# EAGLE design breakout (EAGLE 6.5.0)
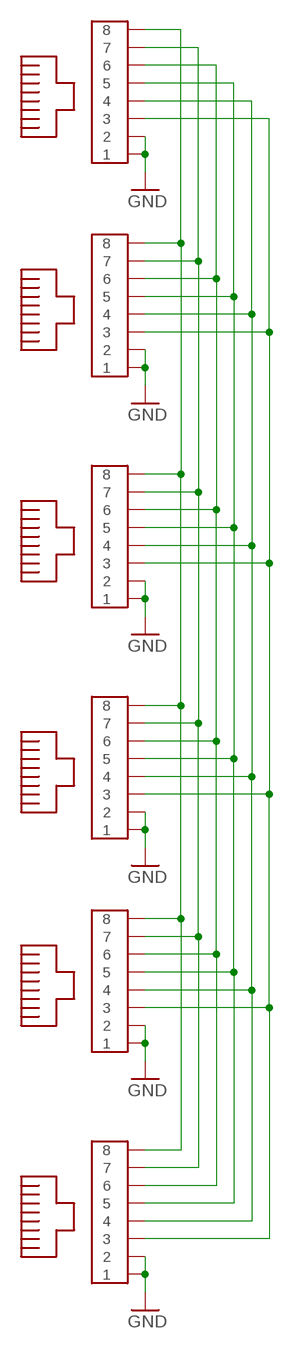
[diagram p0: schematic, sheet 1]

## Parts
U$1  MOLEX-RJ45-SMT  [MOLEX-RJ45-SMT]
U$2  MOLEX-RJ45-SMT  [MOLEX-RJ45-SMT]
U$3  MOLEX-RJ45-SMT  [MOLEX-RJ45-SMT]
U$4  MOLEX-RJ45-SMT  [MOLEX-RJ45-SMT]
U$5  MOLEX-RJ45-SMT  [MOLEX-RJ45-SMT]
U$6  MOLEX-RJ45-SMT  [MOLEX-RJ45-SMT]

## Nets
GND: U$1.1 U$1.2 U$2.1 U$2.2 U$3.1 U$3.2 U$4.1 U$4.2 U$5.1 U$5.2 U$6.1 U$6.2
N$3: U$1.4 U$2.4 U$3.4 U$4.4 U$5.4 U$6.4
N$4: U$1.3 U$2.3 U$3.3 U$4.3 U$5.3 U$6.3
N$6: U$1.5 U$2.5 U$3.5 U$4.5 U$5.5 U$6.5
N$7: U$1.8 U$2.8 U$3.8 U$4.8 U$5.8 U$6.8
N$8: U$1.6 U$2.6 U$3.6 U$4.6 U$5.6 U$6.6
N$13: U$1.7 U$2.7 U$3.7 U$4.7 U$5.7 U$6.7

## Library data of the parts
U$1-U$6 = SMD-RJ45:MOLEX-RJ45-SMT

## Board
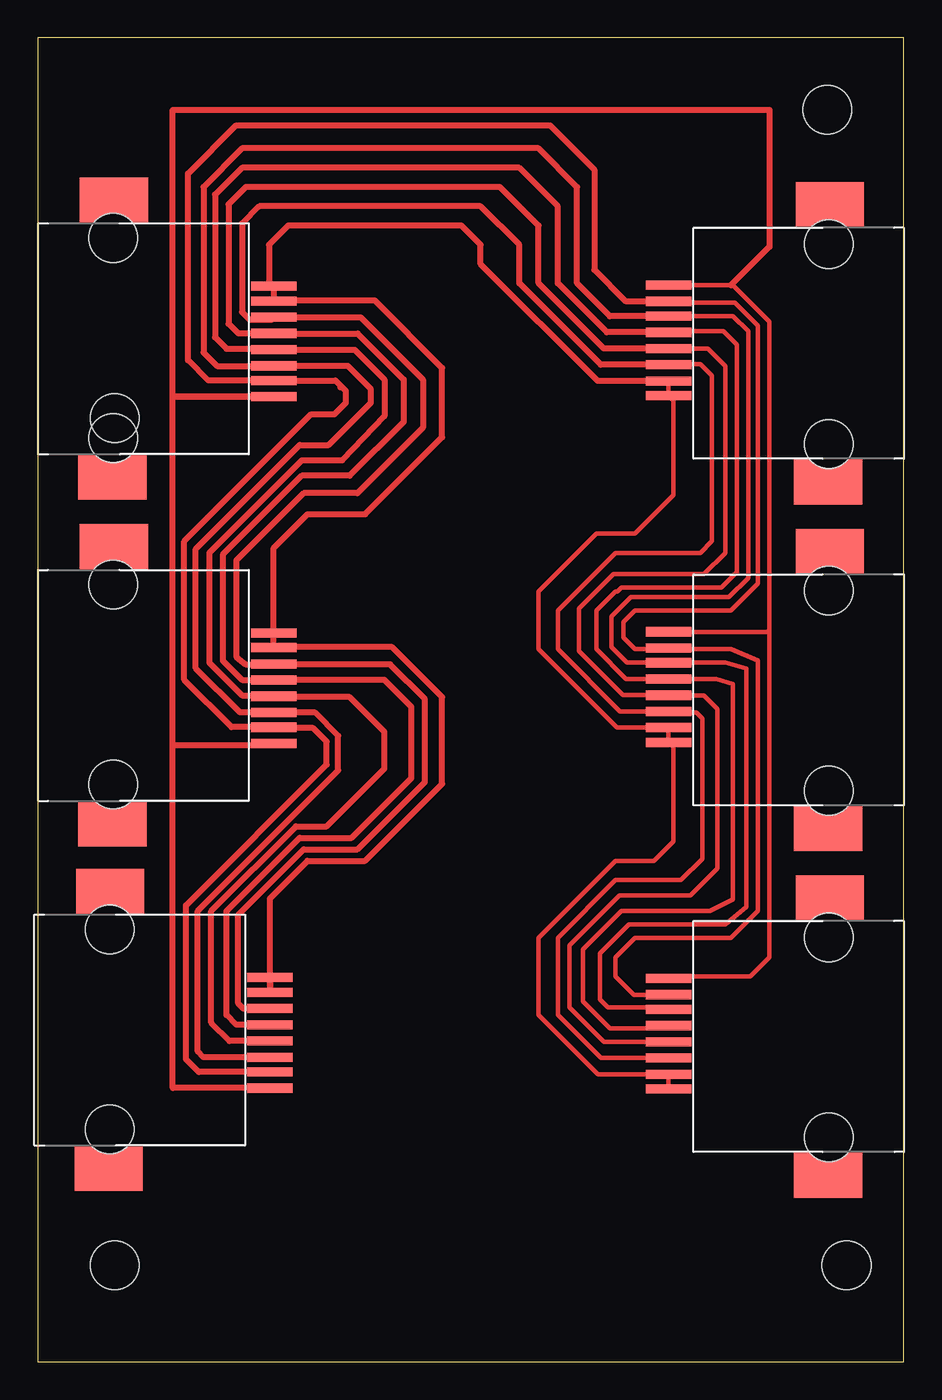
[diagram p1: board, top side]

Size 57.13 x 87.3 mm. Coordinates in mm from the lower left corner, seen from the top.
Outline: 0,0 57.13,0 57.13,87.3 0,87.3 0,0
Copper layers (1*16): Top 0.035mm / dielectric 1.5mm / Bottom 0.035mm
Design rules "default": minimum track width 10mil, minimum drill 24mil, track to track 8mil, track to pad 8mil, pad to pad 8mil, via to via 8mil, smd to smd 8mil, copper to edge 40mil, drill to drill 8mil, minimum pad ring 10mil, minimum via ring 8mil, stop-mask expansion 4mil, vias tented up to drill 0mil, thermal gap 10mil
Holes 3.2 mm at 52.07,82.55 5.08,6.35 53.34,6.35 5.08,62.23

### Footprints (pad centres in the part's own frame; a part is rotated, then mirrored left to right if it is on the bottom)
MOLEX-RJ45-SMT = smd 3 x 0.6: 1 10.48,3.61; 2 10.48,2.64; 3 10.48,1.57; 4 10.48,0.5; 5 10.48,-0.57; 6 10.48,-1.64; 7 10.48,-2.61; 8 10.48,-3.68 | smd 4.5 x 3: P$1 -0.16,-8.97; P$2 -0.06,9.28 | hole 3.2: -0.1,6.8; -0.1,-6.4

### Placement (x,y rotation side)
U$1  5.08,67.31 0 top
U$2  52.07,67.31 180 top
U$3  52.07,21.59 180 top
U$4  52.07,44.45 180 top
U$5  5.08,44.45 0 top
U$6  4.83,21.72 0 top

### Tracks (layer width: path | path; a pad name or v marks a point on that pad's centre or on a via)
GND
  Top 0.254: 41.91,40.64 U$4.1 41.91,40.64
  Top 0.305: U$2.2 U$2.1 41.91,63.38 41.91,57.15 39.37,54.61 36.83,54.61 33.02,50.8 33.02,46.99 38.2,41.81 U$4.2 U$4.1 41.91,40.52 41.91,34.29 40.64,33.02 38.1,33.02 33.02,27.94 33.02,22.86 36.93,18.95 U$3.2 U$3.1
  Top 0.406: U$5.2 U$5.1 | U$6.1 U$6.2 15.31,30.55 17.78,33.02 21.59,33.02 26.67,38.1 26.67,43.81 23.37,47.12 15.59,47.12 U$5.2 | U$5.2 15.56,53.66 17.78,55.88 21.59,55.88 26.67,60.96 26.67,65.53 22.22,69.98 15.59,69.98 U$1.2 U$1.1 15.24,71.24 15.24,73.66 16.51,74.93 27.94,74.93 29.21,73.66 29.21,72.39 36.93,64.67 U$2.2
N$3
  Top 0.305: U$2.4 44.2,66.8 45.34,65.66 45.34,53.34 43.94,51.94 37.97,51.94 35.69,49.66 35.69,46.86 38.6,43.95 U$4.4 43.94,43.94 44.83,43.05 44.83,32.51 43.05,30.73 38.35,30.73 35.05,27.43 35.05,23.37 37.33,21.09 U$3.4
  Top 0.406: U$6.4 arc90 U$6.4 13.09,22.22 12.45,22.86 12.45,29.72 17.27,34.54 20.7,34.54 24.64,38.48 24.64,43.18 22.86,44.96 U$5.4 13.46,44.96 12.19,46.23 12.19,53.21 17.4,58.42 20.57,58.42 24.13,61.98 24.13,64.77 21.09,67.81 U$1.4 13.21,67.82 12.57,68.45 12.57,76.33 13.72,77.47 30.48,77.47 33.02,74.93 33.02,71.12 37.33,66.81 U$2.4
N$4
  Top 0.305: U$3.3 37.13,20.02 34.29,22.86 34.29,27.94 38.1,31.75 42.42,31.75 43.82,33.15 43.82,42.42 43.43,42.8 41.67,42.8 U$4.3 38.4,42.88 34.29,46.99 34.29,49.53 38.1,53.34 43.69,53.34 44.45,54.1 44.45,65.02 43.69,65.79 41.64,65.79 U$2.3
  Top 0.406: U$6.3 13.54,23.29 13.21,23.62 13.21,29.46 17.53,33.78 21.08,33.78 25.53,38.23 25.53,43.69 23.24,45.97 15.61,45.97 U$5.3 15.51,45.97 13.72,45.97 13.08,46.48 13.08,52.83 17.53,57.28 21.08,57.28 25.4,61.59 25.4,64.77 21.29,68.88 U$1.3 15.39,68.71 13.97,68.71 13.46,69.22 13.46,75.06 14.61,76.2 29.21,76.2 31.75,73.66 31.75,71.12 37.13,65.74 U$2.3
N$6
  Top 0.305: U$3.5 41.4,21.97 37.72,21.97 35.94,23.75 35.94,27.18 38.48,29.72 44.32,29.72 45.85,30.48 45.85,44.7 44.77,45.02 U$4.5 38.8,45.02 36.83,46.99 36.83,49.53 38.1,50.8 38.23,50.8 38.48,51.05 45.09,51.05 46.1,52.07 46.1,67.06 45.21,67.95 41.66,67.95 U$2.5
  Top 0.406: U$6.5 12.63,21.15 11.43,22.35 11.43,29.72 17.02,35.31 19.05,35.31 22.86,39.12 22.86,41.53 20.57,43.81 15.62,43.81 U$5.5 15.5,43.94 13.46,43.94 11.3,46.1 11.3,53.34 17.4,59.44 20.07,59.44 22.86,62.36 22.86,64.77 20.89,66.74 U$1.5 15.5,66.8 12.45,66.8 11.68,67.56 11.68,76.96 13.46,78.74 31.75,78.74 34.29,76.2 34.29,71.12 37.53,67.88 U$2.5
N$7
  Top 0.305: U$2.8 45.72,70.99 45.85,70.99 48.26,68.58 48.26,48.26 | 48.26,48.26 48.26,26.67 46.99,25.4 41.72,25.4 U$3.8 | U$4.8 48.13,48.13 48.26,48.26
  Top 0.406: U$5.8 15.43,40.64 8.89,40.64 | 8.89,40.64 8.89,63.63 U$1.8 8.89,63.63 8.89,82.55 48.26,82.55 48.26,73.53 45.72,70.99 | U$6.8 8.89,18.04 8.89,40.64
N$8
  Top 0.305: 41.45,46.23 U$4.6 | U$4.6 45.35,46.09 46.74,45.72 46.74,29.97 45.34,28.83 38.99,28.83 37.08,26.92 37.08,23.88 37.59,23.37 41.45,23.37 U$3.6 | U$4.6 41.58,46.1 38.86,46.1 37.85,47.12 37.85,49.15 39.12,50.42 45.59,50.42 46.86,51.69 46.86,67.95 45.86,68.95 U$2.6 41.58,68.96
  Top 0.406: U$6.6 10.91,20.08 10.54,20.45 10.54,29.72 19.81,38.99 19.81,41.27 18.29,42.8 U$5.6 13.32,42.81 10.41,45.72 10.41,53.59 17.27,60.45 19.18,60.45 21.97,63.25 21.97,64.14 20.45,65.66 15.57,65.66 U$1.6 15.55,65.66 11.81,65.66 10.92,66.55 10.92,77.47 13.46,80.01 33.02,80.01 35.56,77.47 35.56,71.12 37.73,68.95 U$2.6
N$13
  Top 0.254: 43.18,69.85 41.91,69.85 U$2.7 | 43.18,46.99 41.91,46.99 U$4.7
  Top 0.305: U$3.7 39.3,24.2 38.1,25.4 38.1,26.67 39.37,27.94 45.72,27.94 47.5,29.72 47.5,46.23 45.72,46.99 41.66,46.99 U$4.7 41.52,46.99 39.37,46.99 38.61,47.75 38.61,48.77 39.37,49.53 45.72,49.53 47.5,51.31 47.5,68.33 45.97,69.85 41.91,69.85
  Top 0.406: 20.07,64.26 20.32,64.01 20.32,63.25 19.56,62.48 18.03,62.48 9.65,54.1 9.65,44.96 12.77,41.84 U$5.7 15.63,41.91 16.51,41.91 16.64,41.78 18.16,41.78 19.05,40.89 19.05,39.37 9.78,30.1 9.78,19.94 10.61,19.11 U$6.7 | 20.07,64.26 19.94,64.26 | 20.07,64.26 19.63,64.7 U$1.7 11.25,64.7 9.91,66.04 9.91,78.36 13.08,81.53 33.78,81.53 36.7,78.61 36.7,72.01 38.79,69.92 U$2.7